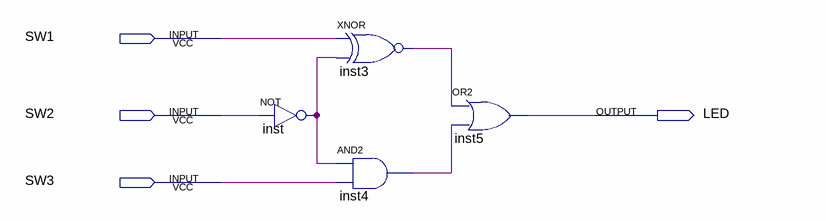
[diagram p0: schematic sheet]
// Quartus schematic Block2.bdf as structural Verilog: 4 symbols, 4 pins
module Block2 (
  input  SW1,
  input  SW2,
  input  SW3,
  output LED
);

  wire inst3_out, inst4_out, inst_out;

  not inst (inst_out, SW2);
  xnor inst3 (inst3_out, SW1, inst_out);
  and inst4 (inst4_out, inst_out, SW3);
  or inst5 (LED, inst3_out, inst4_out);
endmodule
